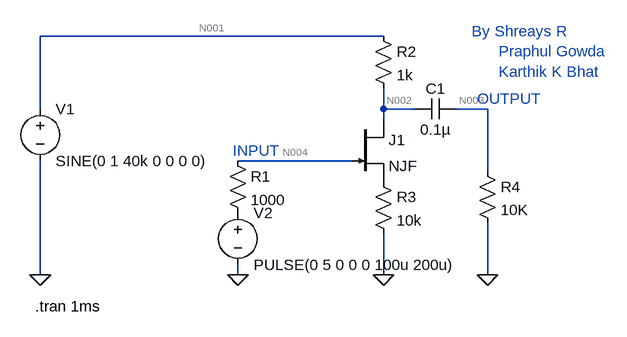
[diagram p0: schematic am.asc]
am.asc, the LTspice schematic file:
Version 4
SHEET 1 880 680
WIRE 192 -16 -336 -16
WIRE -336 96 -336 -16
WIRE 192 96 192 64
WIRE 240 96 192 96
WIRE 352 96 304 96
WIRE 192 112 192 96
WIRE 144 176 -32 176
WIRE 352 192 352 96
WIRE -336 352 -336 176
WIRE -32 352 -32 336
WIRE 192 352 192 288
WIRE 352 352 352 272
FLAG 192 352 0
FLAG -32 352 0
FLAG -336 352 0
FLAG 352 352 0
SYMBOL njf 144 112 R0
SYMATTR InstName J1
SYMBOL res -48 160 R0
SYMATTR InstName R1
SYMATTR Value 1000
SYMBOL res 176 -32 R0
SYMATTR InstName R2
SYMATTR Value 1k
SYMBOL res 176 192 R0
SYMATTR InstName R3
SYMATTR Value 10k
SYMBOL voltage -336 80 R0
WINDOW 123 0 0 Left 0
WINDOW 39 0 0 Left 0
SYMATTR InstName V1
SYMATTR Value SINE(0 1 40k 0 0 0 0)
SYMBOL voltage -32 240 R0
WINDOW 123 0 0 Left 0
WINDOW 39 0 0 Left 0
SYMATTR InstName V2
SYMATTR Value PULSE(0 5 0 0 0 100u 200u)
SYMBOL cap 304 80 R90
WINDOW 0 0 32 VBottom 2
WINDOW 3 32 32 VTop 2
SYMATTR InstName C1
SYMATTR Value 0.1µ
SYMBOL res 336 176 R0
SYMATTR InstName R4
SYMATTR Value 10K
TEXT -344 400 Left 2 !.tran 1ms
TEXT -40 160 Left 2 ;INPUT
TEXT 336 80 Left 2 ;OUTPUT
TEXT 328 -24 Left 2 ;By Shreays R\n      Praphul Gowda\n      Karthik K Bhat

The netlist it stands for:
* am.asc
J1 N002 N004 P001 NJF
R1 N004 P002 1000
R2 N001 N002 1k
R3 P001 0 10k
V1 N001 0 SINE(0 1 40k 0 0 0 0)
V2 P002 0 PULSE(0 5 0 0 0 100u 200u)
C1 N003 N002 0.1µ
R4 N003 0 10K
.model NJF NJF
.model PJF PJF
.lib standard.jft
.tran 1ms
* INPUT
* OUTPUT
* By Shreays R
*       Praphul Gowda
*       Karthik K Bhat
.backanno
.end

* Results of the author's LTspice run, read from the files saved beside the schematic
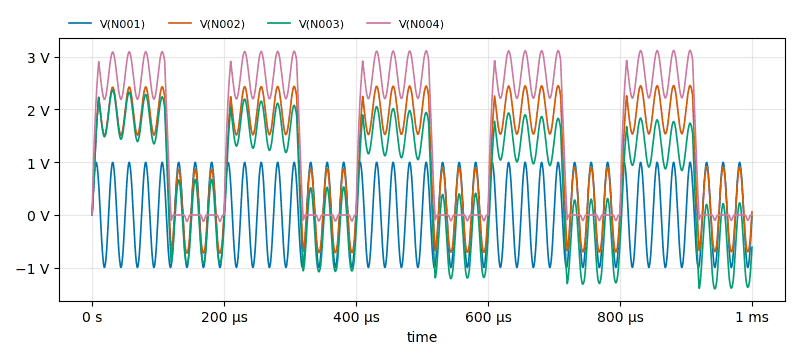
[diagram p1: Transient Analysis of am.asc, plotted from the saved traces]
* Transient Analysis, 1 run:
*   V(N001): min -997.6 mV, max 997.6 mV, average 32.51 µV, rms 700.7 mV, last 0 V
*   V(N002): min -723.2 mV, max 2.453 V, average 1.097 V, rms 1.518 V, last 56.53 mV
*   V(N003): min -1.401 V, max 2.37 V, average 667.3 mV, rms 1.28 V, last -610.3 mV
*   V(N004): min -122.6 mV, max 3.12 V, average 1.475 V, rms 1.974 V, last 0 V